# EAGLE schematic Environment-ArduinoNano44-Mini-Enclosure-V10-Bottom (EAGLE 7.4.0)
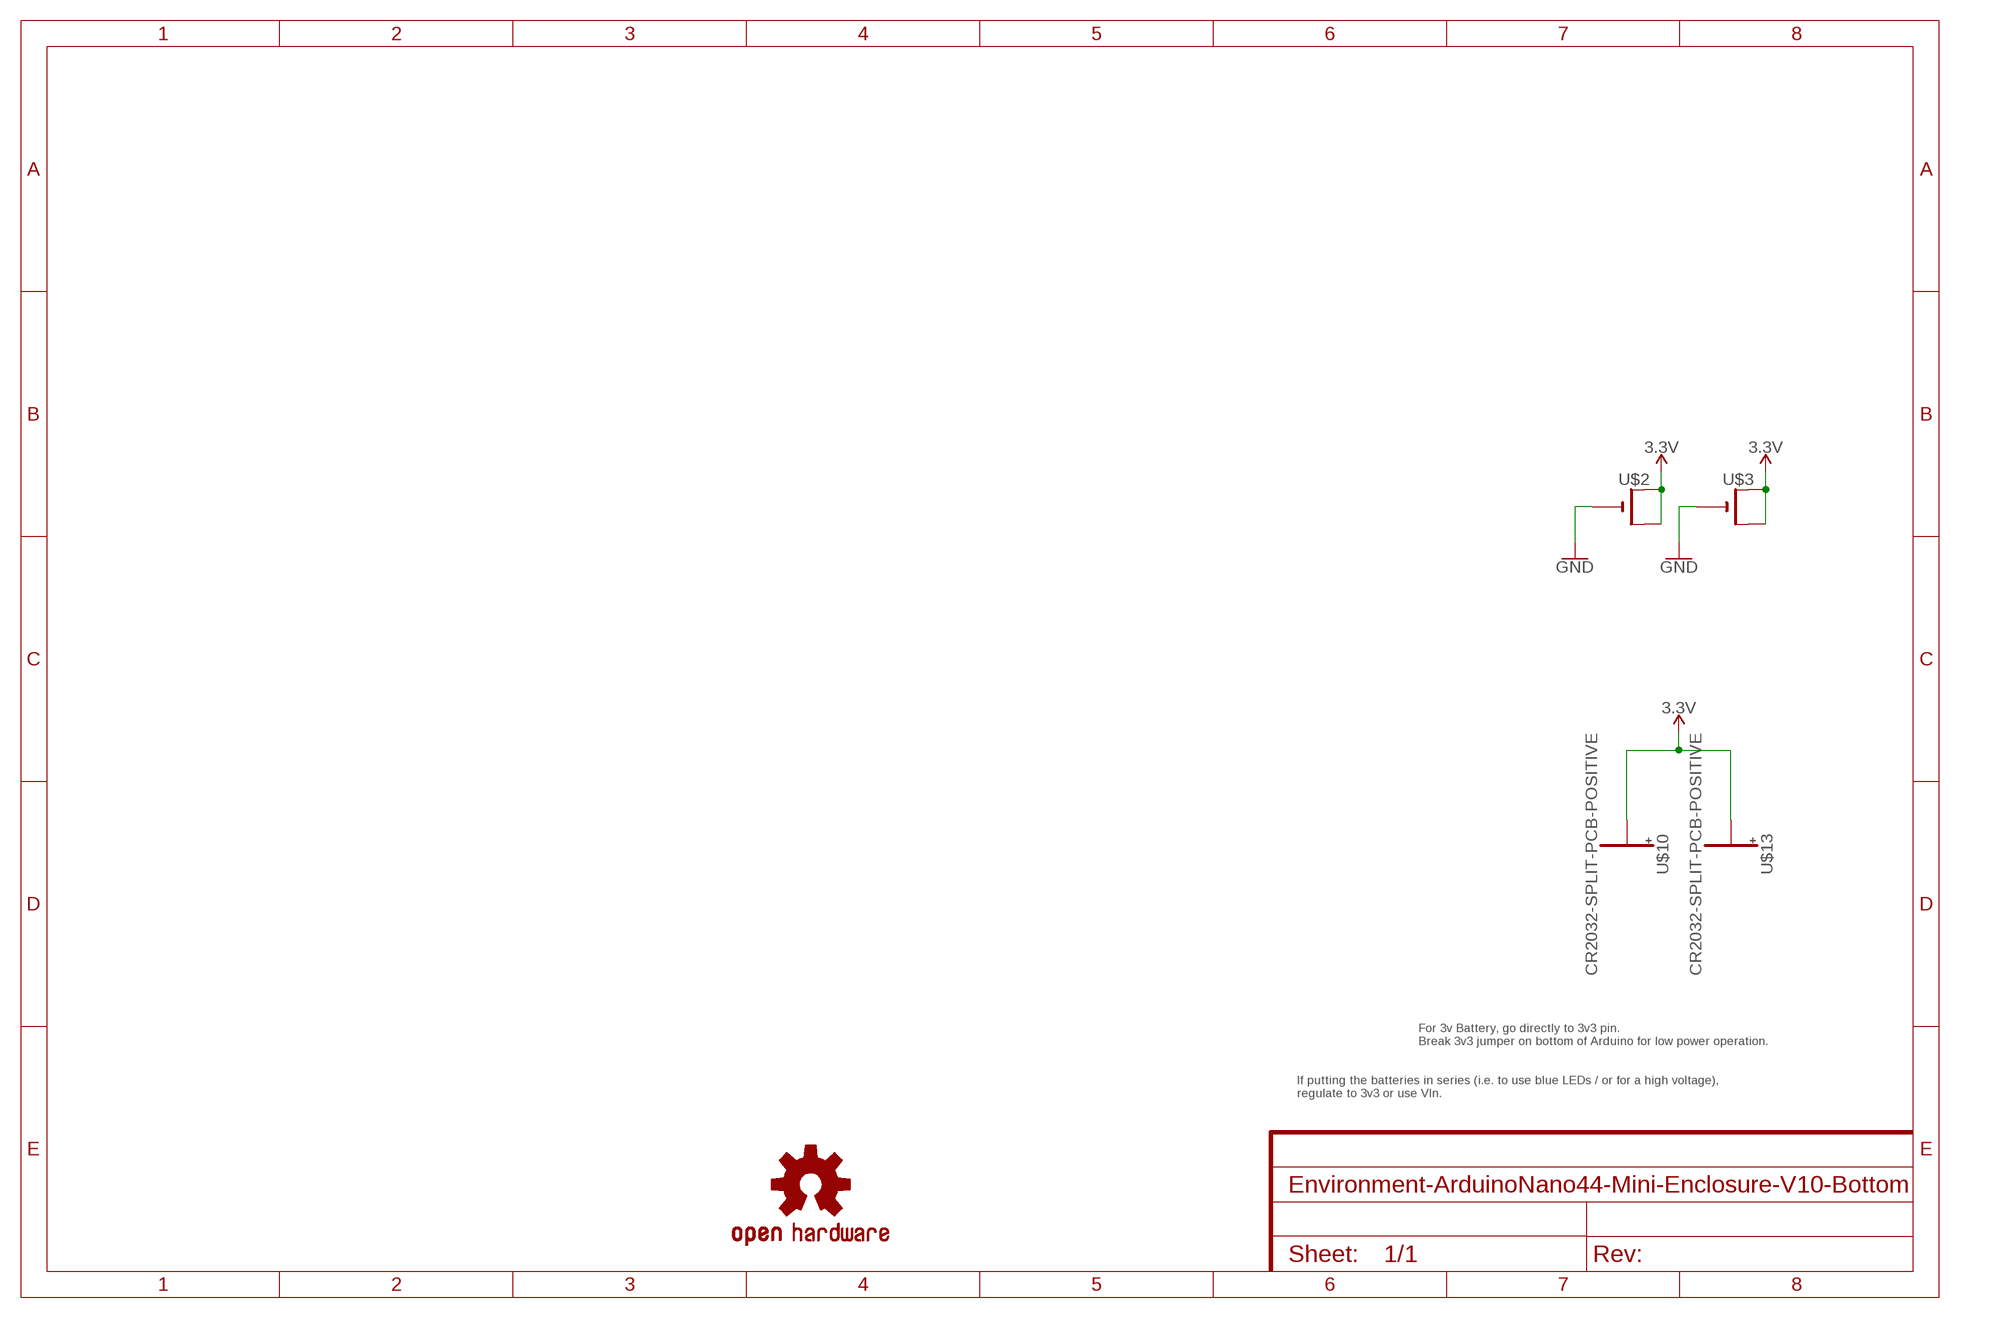
[diagram p0: schematic, sheet 1]

## Parts
LOGO3  OSHW-LOGOL  [OSHW-LOGO-L]
U$2  CR2032SMT  [CR2032-SMD]
U$3  CR2032SMT  [CR2032-SMD]
U$10  CR2032-SPLIT-PCB-POSITIVE  [CR2032-SMD-POSITIVE-TERMINAL]
U$13  CR2032-SPLIT-PCB-POSITIVE  [CR2032-SMD-POSITIVE-TERMINAL]

## Nets
3.3V: U$2.+$1(+) U$2.+$2(+1) U$3.+$1(+) U$3.+$2(+1) U$10.+ U$13.+
GND: U$2.- U$3.-

## Notes on the sheet
- For 3v Battery, go directly to 3v3 pin.
  Break 3v3 jumper on bottom of Arduino for low power operation.
- If putting the batteries in series (i.e. to use blue LEDs / or for a high voltage), 
  regulate to 3v3 or use VIn.

## Library data of the parts
LOGO3 = SparkFun-Aesthetics:OSHW-LOGO: Open-Source Hardware (OSHW) Logo This logo indicates the piece of hardware it is found on incorporates a OSHW license and/or adheres to the definition of open source hardware found here: http://freedomdefined.org/OSHW
U$2 U$3 = ThingySticks:CR2032
U$10 U$13 = ThingySticks:CR2032-SPLIT-PCB-POSITIVE